# EAGLE design M500B (EAGLE 6.6.0)
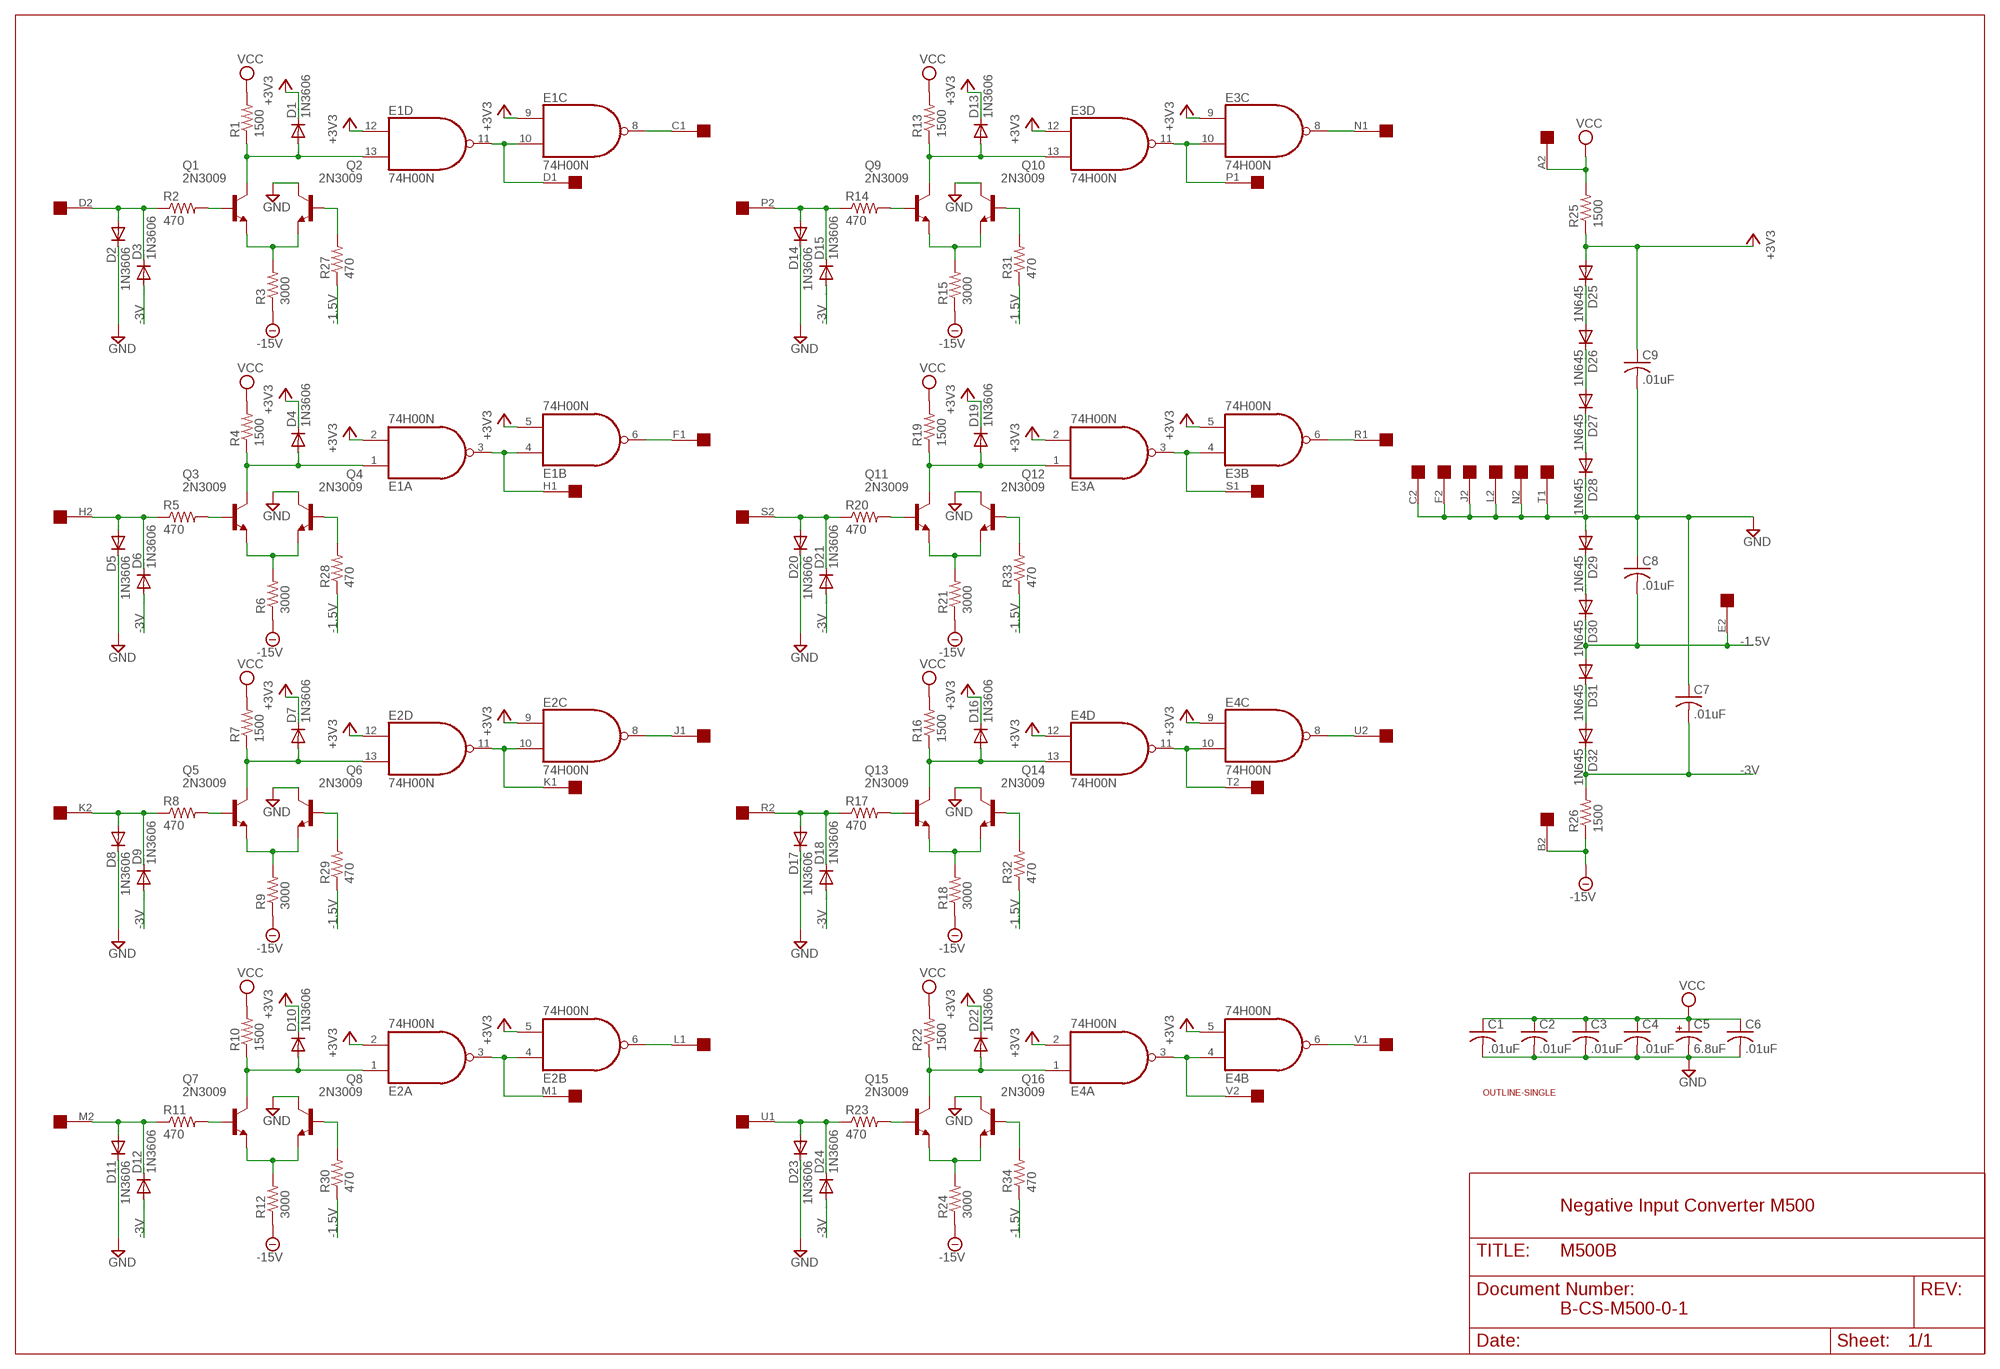
[diagram p0: schematic, sheet 1]

## Parts
C1  .01uF  C-US050-025X075  [C050-025X075]
C2  .01uF  C-US050-025X075  [C050-025X075]
C3  .01uF  C-US050-025X075  [C050-025X075]
C4  .01uF  C-US050-025X075  [C050-025X075]
C5  6.8uF  CPOL-USE20-8AXIAL  [E12-8]
C6  .01uF  C-US050-025X075  [C050-025X075]
C7  .01uF  C-US050-025X075  [C050-025X075]
C8  .01uF  C-US050-025X075  [C050-025X075]
C9  .01uF  C-US050-025X075  [C050-025X075]
D1  1N3606  1N4148DO35-10  [DO35-10]
D2  1N3606  1N4148DO35-10  [DO35-10]
D3  1N3606  1N4148DO35-10  [DO35-10]
D4  1N3606  1N4148DO35-10  [DO35-10]
D5  1N3606  1N4148DO35-10  [DO35-10]
D6  1N3606  1N4148DO35-10  [DO35-10]
D7  1N3606  1N4148DO35-10  [DO35-10]
D8  1N3606  1N4148DO35-10  [DO35-10]
D9  1N3606  1N4148DO35-10  [DO35-10]
D10  1N3606  1N4148DO35-10  [DO35-10]
D11  1N3606  1N4148DO35-10  [DO35-10]
D12  1N3606  1N4148DO35-10  [DO35-10]
D13  1N3606  1N4148DO35-10  [DO35-10]
D14  1N3606  1N4148DO35-10  [DO35-10]
D15  1N3606  1N4148DO35-10  [DO35-10]
D16  1N3606  1N4148DO35-10  [DO35-10]
D17  1N3606  1N4148DO35-10  [DO35-10]
D18  1N3606  1N4148DO35-10  [DO35-10]
D19  1N3606  1N4148DO35-10  [DO35-10]
D20  1N3606  1N4148DO35-10  [DO35-10]
D21  1N3606  1N4148DO35-10  [DO35-10]
D22  1N3606  1N4148DO35-10  [DO35-10]
D23  1N3606  1N4148DO35-10  [DO35-10]
D24  1N3606  1N4148DO35-10  [DO35-10]
D25  1N645  1N4148DO35-10  [DO35-10]
D26  1N645  1N4148DO35-10  [DO35-10]
D27  1N645  1N4148DO35-10  [DO35-10]
D28  1N645  1N4148DO35-10  [DO35-10]
D29  1N645  1N4148DO35-10  [DO35-10]
D30  1N645  1N4148DO35-10  [DO35-10]
D31  1N645  1N4148DO35-10  [DO35-10]
D32  1N645  1N4148DO35-10  [DO35-10]
E1  74H00N  7400N  [DIL14]
E2  74H00N  7400N  [DIL14]
E3  74H00N  7400N  [DIL14]
E4  74H00N  7400N  [DIL14]
Q1  2N3009  2N3019  [TO39]
Q2  2N3009  2N3019  [TO39]
Q3  2N3009  2N3019  [TO39]
Q4  2N3009  2N3019  [TO39]
Q5  2N3009  2N3019  [TO39]
Q6  2N3009  2N3019  [TO39]
Q7  2N3009  2N3019  [TO39]
Q8  2N3009  2N3019  [TO39]
Q9  2N3009  2N3019  [TO39]
Q10  2N3009  2N3019  [TO39]
Q11  2N3009  2N3019  [TO39]
Q12  2N3009  2N3019  [TO39]
Q13  2N3009  2N3019  [TO39]
Q14  2N3009  2N3019  [TO39]
Q15  2N3009  2N3019  [TO39]
Q16  2N3009  2N3019  [TO39]
R1  1500  R-US_0207/10  [0207/10]
R2  470  R-US_0207/10  [0207/10]
R3  3000  R-US_0207/10  [0207/10]
R4  1500  R-US_0207/10  [0207/10]
R5  470  R-US_0207/10  [0207/10]
R6  3000  R-US_0207/10  [0207/10]
R7  1500  R-US_0207/10  [0207/10]
R8  470  R-US_0207/10  [0207/10]
R9  3000  R-US_0207/10  [0207/10]
R10  1500  R-US_0207/10  [0207/10]
R11  470  R-US_0207/10  [0207/10]
R12  3000  R-US_0207/10  [0207/10]
R13  1500  R-US_0207/10  [0207/10]
R14  470  R-US_0207/10  [0207/10]
R15  3000  R-US_0207/10  [0207/10]
R16  1500  R-US_0207/10  [0207/10]
R17  470  R-US_0207/10  [0207/10]
R18  3000  R-US_0207/10  [0207/10]
R19  1500  R-US_0207/10  [0207/10]
R20  470  R-US_0207/10  [0207/10]
R21  3000  R-US_0207/10  [0207/10]
R22  1500  R-US_0207/10  [0207/10]
R23  470  R-US_0207/10  [0207/10]
R24  3000  R-US_0207/10  [0207/10]
R25  1500  R-US_0207/10  [0207/10]
R26  1500  R-US_0207/10  [0207/10]
R27  470  R-US_0207/10  [0207/10]
R28  470  R-US_0207/10  [0207/10]
R29  470  R-US_0207/10  [0207/10]
R30  470  R-US_0207/10  [0207/10]
R31  470  R-US_0207/10  [0207/10]
R32  470  R-US_0207/10  [0207/10]
R33  470  R-US_0207/10  [0207/10]
R34  470  R-US_0207/10  [0207/10]
U$1  OUTLINE-SINGLE  [SINGLE]
U$3  SINGLE  [EDGE-CON2]

## Nets
+3V3 [power]: C9.1 D1.C D4.C D7.C D10.C D13.C D16.C D19.C D22.C D25.A E1.2(A:I1) E1.5(B:I1) E1.9(C:I0) E1.12(D:I0) E2.2(A:I1) E2.5(B:I1) E2.9(C:I0) E2.12(D:I0) E3.2(A:I1) E3.5(B:I1) E3.9(C:I0) E3.12(D:I0) E4.2(A:I1) E4.5(B:I1) E4.9(C:I0) E4.12(D:I0) R25.1
-1.5V: C8.2 D30.C D31.A R27.1 R28.1 R29.1 R30.1 R31.1 R32.1 R33.1 R34.1 U$3.E2
-3V: C7.2 D3.A D6.A D9.A D12.A D15.A D18.A D21.A D24.A D32.C R26.2
-15V: R3.1 R6.1 R9.1 R12.1 R15.1 R18.1 R21.1 R24.1 R26.1 U$3.B2
GND [power]: C1.2 C2.2 C3.2 C4.2 C5.- C6.2 C7.1 C8.1 C9.2 D2.C D5.C D8.C D11.C D14.C D17.C D20.C D23.C D28.C D29.A Q2.3(C) Q4.3(C) Q6.3(C) Q8.3(C) Q10.3(C) Q12.3(C) Q14.3(C) Q16.3(C) U$3.C2 U$3.F2 U$3.J2 U$3.L2 U$3.N2 U$3.T1
N$1: E1.10(C:I1) E1.11(D:O) U$3.D1
N$2: E1.8(C:O) U$3.C1
N$3: Q1.1(E) Q2.1(E) R3.2
N$4: D1.A E1.13(D:I1) Q1.3(C) R1.1
N$5: Q1.2(B) R2.2
N$6: D2.A D3.C R2.1 U$3.D2
N$8: Q2.2(B) R27.2
N$9: E1.3(A:O) E1.4(B:I0) U$3.H1
N$10: E1.6(B:O) U$3.F1
N$11: Q3.1(E) Q4.1(E) R6.2
N$12: D4.A E1.1(A:I0) Q3.3(C) R4.1
N$13: Q3.2(B) R5.2
N$14: D5.A D6.C R5.1 U$3.H2
N$15: D27.C D28.A
N$16: Q4.2(B) R28.2
N$17: E2.10(C:I1) E2.11(D:O) U$3.K1
N$18: E2.8(C:O) U$3.J1
N$19: Q5.1(E) Q6.1(E) R9.2
N$20: D7.A E2.13(D:I1) Q5.3(C) R7.1
N$21: Q5.2(B) R8.2
N$22: D8.A D9.C R8.1 U$3.K2
N$23: D26.C D27.A
N$24: Q6.2(B) R29.2
N$25: E2.3(A:O) E2.4(B:I0) U$3.M1
N$26: E2.6(B:O) U$3.L1
N$27: Q7.1(E) Q8.1(E) R12.2
N$28: D10.A E2.1(A:I0) Q7.3(C) R10.1
N$29: Q7.2(B) R11.2
N$30: D11.A D12.C R11.1 U$3.M2
N$31: D25.C D26.A
N$32: Q8.2(B) R30.2
N$33: E3.10(C:I1) E3.11(D:O) U$3.P1
N$34: E3.8(C:O) U$3.N1
N$35: Q9.1(E) Q10.1(E) R15.2
N$36: D13.A E3.13(D:I1) Q9.3(C) R13.1
N$37: Q9.2(B) R14.2
N$38: D14.A D15.C R14.1 U$3.P2
N$39: D29.C D30.A
N$40: Q10.2(B) R31.2
N$41: E3.3(A:O) E3.4(B:I0) U$3.S1
N$42: E3.6(B:O) U$3.R1
N$43: Q11.1(E) Q12.1(E) R21.2
N$44: D19.A E3.1(A:I0) Q11.3(C) R19.1
N$45: Q11.2(B) R20.2
N$46: D20.A D21.C R20.1 U$3.S2
N$47: D31.C D32.A
N$48: Q12.2(B) R33.2
N$49: E4.10(C:I1) E4.11(D:O) U$3.T2
N$50: E4.8(C:O) U$3.U2
N$51: Q13.1(E) Q14.1(E) R18.2
N$52: D16.A E4.13(D:I1) Q13.3(C) R16.1
N$53: Q13.2(B) R17.2
N$54: D17.A D18.C R17.1 U$3.R2
N$56: Q14.2(B) R32.2
N$57: E4.3(A:O) E4.4(B:I0) U$3.V2
N$58: E4.6(B:O) U$3.V1
N$59: Q15.1(E) Q16.1(E) R24.2
N$60: D22.A E4.1(A:I0) Q15.3(C) R22.1
N$61: Q15.2(B) R23.2
N$62: D23.A D24.C R23.1 U$3.U1
N$64: Q16.2(B) R34.2
VCC [power]: C1.1 C2.1 C3.1 C4.1 C5.+ C6.1 R1.2 R4.2 R7.2 R10.2 R13.2 R16.2 R19.2 R22.2 R25.2 U$3.A2
Unconnected: U$3.A1 U$3.B1 U$3.E1

## Notes on the sheet
- Negative Input Converter M500
- B-CS-M500-0-1

## Power pins joined to a net without a drawn wire
GND: E1.7(P:GND) E2.7(P:GND) E3.7(P:GND) E4.7(P:GND)
VCC: E1.14(P:VCC) E2.14(P:VCC) E3.14(P:VCC) E4.14(P:VCC)

## Library data of the parts
C1-C4 C6-C9 = rcl:C-US: CAPACITOR, American symbol
C5 = dec-con:CPOL-USE20-8AXIAL: A 0.8 inch electrolytic.
D1-D32 = diode:1N4148: DIODE high speed (Philips)
E1-E4 = 74xx-us:74*00: Quad 2-input NAND gate
Q1-Q16 = transistor-npn:2N3019: NPN Transistor
R1-R34 = rcl:R-US_: RESISTOR, American symbol
U$1 = dec-con:OUTLINE-*: Board outlines for DEC boards.
U$3 = dec-con:SINGLE: Single-Height DEC board

## Net classes
1 power: width 0.813 mm

## Board
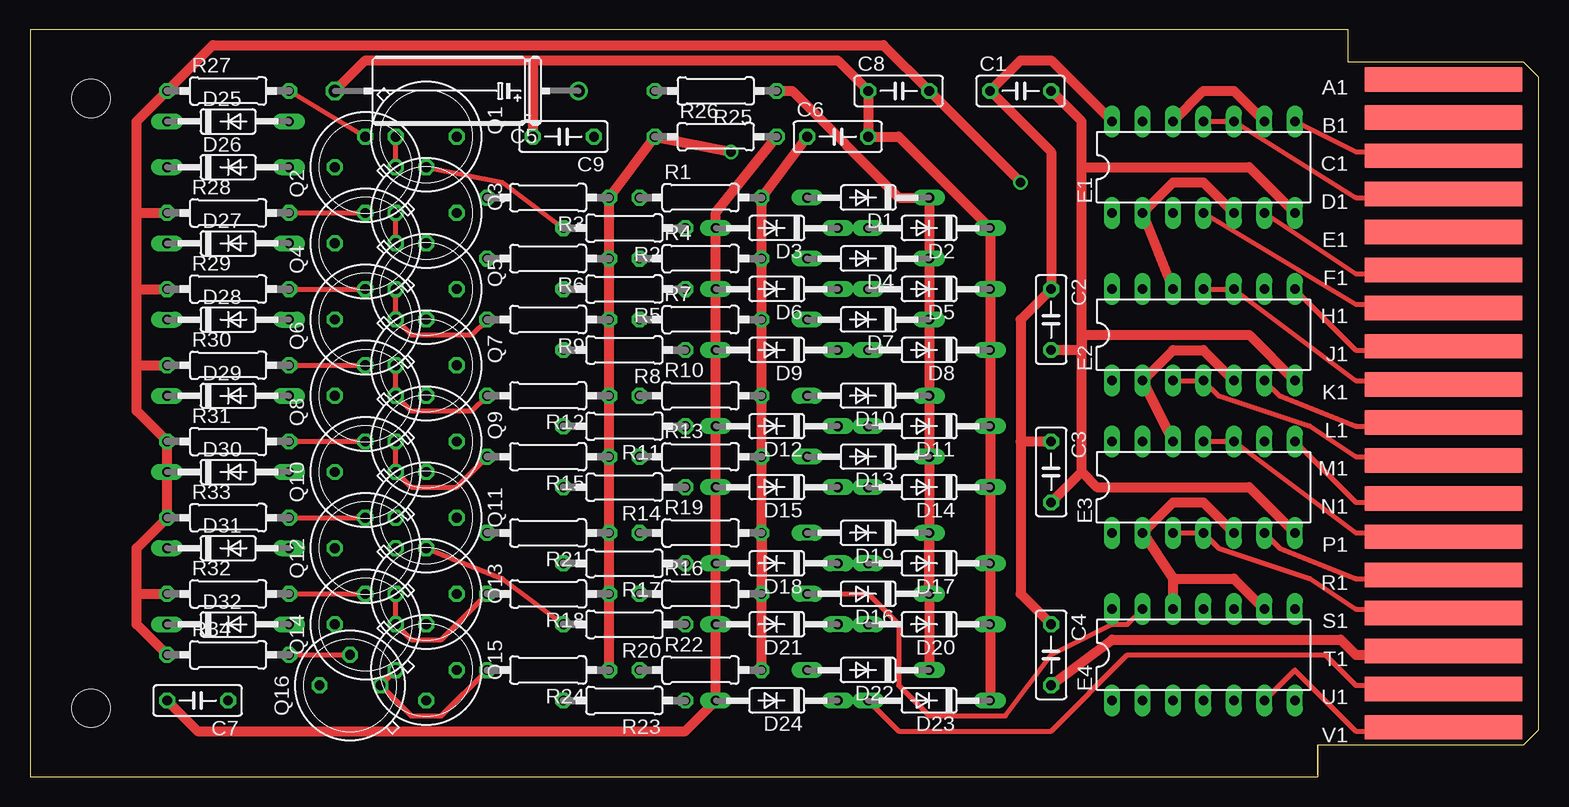
[diagram p1: board, top side]
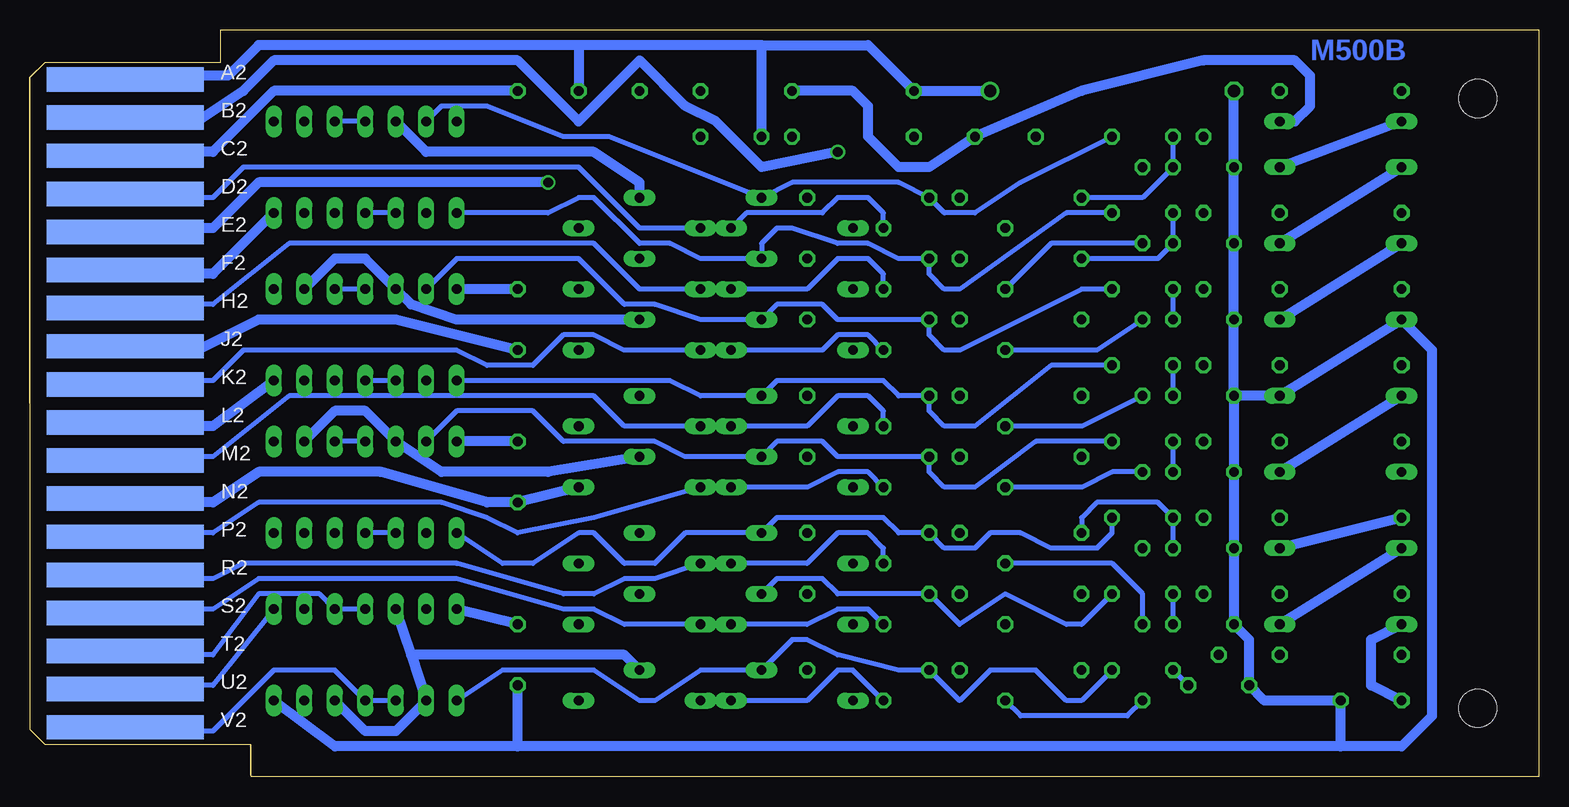
[diagram p2: board, bottom side, seen from below]

Size 125.73 x 62.23 mm. Coordinates in mm from the lower left corner, seen from the top.
Copper layers (1+16): Top 0.035mm / dielectric 1.5mm / Bottom 0.035mm
Design rules "16mils": minimum track width 16mil, minimum drill 32mil, track to track 15mil, track to pad 10mil, pad to pad 10mil, via to via 10mil, smd to smd 10mil, copper to edge 13mil, drill to drill 10mil, minimum pad ring 10mil, minimum via ring 8mil, stop-mask expansion 0mil, vias tented up to drill 0mil, thermal gap 10mil

### Footprints (pad centres in the part's own frame; a part is rotated, then mirrored left to right if it is on the bottom)
C050-025X075 = drill 0.813 octagon: 1 -2.54,0; 2 2.54,0
E12-8 = drill 1.016: + -10.16,0 | drill 1.016 octagon: - 10.16,0
DO35-10 = drill 0.813 long: A 5.08,0; C -5.08,0
DIL14 = drill 0.813 long: 1 -7.62,-3.81; 2 -5.08,-3.81; 3 -2.54,-3.81; 4 0,-3.81; 5 2.54,-3.81; 6 5.08,-3.81; 7 7.62,-3.81; 8 7.62,3.81; 9 5.08,3.81; 10 2.54,3.81; 11 0,3.81; 12 -2.54,3.81; 13 -5.08,3.81; 14 -7.62,3.81
TO39 = drill 0.813 octagon: 1 0,-2.54; 2 2.54,0; 3 0,2.54
0207/10 = drill 0.813 octagon: 1 -5.08,0; 2 5.08,0
SINGLE = hole 3.175: 120.65,56.515; 120.65,5.715
EDGE-CON2 = smd 13.106 x 2.032: A1 7.938,4.128; B1 7.938,7.303; C1 7.938,10.477; D1 7.938,13.652; E1 7.938,16.828; F1 7.938,20.003; H1 7.938,23.177; J1 7.938,26.352; K1 7.938,29.527; L1 7.938,32.703; M1 7.938,35.877; N1 7.938,39.053; P1 7.938,42.227; R1 7.938,45.403; S1 7.938,48.578; T1 7.938,51.752; U1 7.938,54.928; V1 7.938,58.102 | smd 13.106 x 2.032 bottom: A2 7.938,4.128; B2 7.938,7.303; C2 7.938,10.477; D2 7.938,13.652; E2 7.938,16.828; F2 7.938,20.003; H2 7.938,23.177; J2 7.938,26.352; K2 7.938,29.527; L2 7.938,32.703; M2 7.938,35.877; N2 7.938,39.053; P2 7.938,42.227; R2 7.938,45.403; S2 7.938,48.578; T2 7.938,51.752; U2 7.938,54.928; V2 7.938,58.102

### Placement (x,y rotation side)
C1  82.55,57.15 0 top
C2  85.09,38.1 270 top
C3  85.09,25.4 270 top
C4  85.09,10.16 270 top
C5  35.56,57.15 180 top
C6  67.31,53.34 0 top
C7  13.97,6.35 180 top
C8  72.39,57.15 0 top
C9  44.45,53.34 180 top
D1  69.85,48.26 180 top
D2  74.93,45.72 180 top
D3  62.23,45.72 180 top
D4  69.85,43.18 180 top
D5  74.93,40.64 180 top
D6  62.23,40.64 180 top
D7  69.85,38.1 180 top
D8  74.93,35.56 180 top
D9  62.23,35.56 180 top
D10  69.85,31.75 180 top
D11  74.93,29.21 180 top
D12  62.23,29.21 180 top
D13  69.85,26.67 180 top
D14  74.93,24.13 180 top
D15  62.23,24.13 180 top
D16  69.85,15.24 180 top
D17  74.93,17.78 180 top
D18  62.23,17.78 180 top
D19  69.85,20.32 180 top
D20  74.93,12.7 180 top
D21  62.23,12.7 180 top
D22  69.85,8.89 180 top
D23  74.93,6.35 180 top
D24  62.23,6.35 180 top
D25  16.51,54.61 0 top
D26  16.51,50.8 0 top
D27  16.51,44.45 0 top
D28  16.51,38.1 0 top
D29  16.51,31.75 0 top
D30  16.51,25.4 0 top
D31  16.51,19.05 0 top
D32  16.51,12.7 0 top
E1  97.79,50.8 0 top
E2  97.79,36.83 0 top
E3  97.79,24.13 0 top
E4  97.79,10.16 0 top
Q1  33.02,53.34 270 top
Q2  27.94,50.8 90 top
Q3  33.02,46.99 270 top
Q4  27.94,44.45 90 top
Q5  33.02,40.64 270 top
Q6  27.94,38.1 90 top
Q7  33.02,34.29 270 top
Q8  27.94,31.75 90 top
Q9  33.02,27.94 270 top
Q10  27.94,25.4 90 top
Q11  33.02,21.59 270 top
Q12  27.94,19.05 90 top
Q13  33.02,15.24 270 top
Q14  27.94,12.7 90 top
Q15  33.02,8.89 270 top
Q16  26.67,7.62 90 top
R1  55.88,48.26 0 top
R2  49.53,45.72 180 top
R3  43.18,48.26 180 top
R4  55.88,43.18 0 top
R5  49.53,40.64 180 top
R6  43.18,43.18 180 top
R7  55.88,38.1 0 top
R8  49.53,35.56 180 top
R9  43.18,38.1 180 top
R10  55.88,31.75 0 top
R11  49.53,29.21 180 top
R12  43.18,31.75 180 top
R13  55.88,26.67 0 top
R14  49.53,24.13 180 top
R15  43.18,26.67 180 top
R16  55.88,15.24 0 top
R17  49.53,17.78 180 top
R18  43.18,15.24 180 top
R19  55.88,20.32 0 top
R20  49.53,12.7 180 top
R21  43.18,20.32 180 top
R22  55.88,8.89 0 top
R23  49.53,6.35 180 top
R24  43.18,8.89 180 top
R25  57.15,57.15 180 top
R26  57.15,53.34 0 top
R27  16.51,57.15 0 top
R28  16.51,46.99 0 top
R29  16.51,40.64 0 top
R30  16.51,34.29 0 top
R31  16.51,27.94 0 top
R32  16.51,15.24 0 top
R33  16.51,21.59 0 top
R34  16.51,10.16 0 top
U$1  125.73,62.23 180 top
U$3  125.73,62.23 180 top

### Tracks (layer width: path | path; a pad name or v marks a point on that pad's centre or on a via)
+3V3
  Top 0.813: D22.C D19.C D16.C D13.C D10.C D7.C D4.C D1.C 72.39,48.26 63.5,57.15 R25.1 | E4.9 100.33,16.51 95.25,16.51 | E4.12 95.25,16.51 | 95.25,16.51 E3.2 95.25,22.86 97.79,22.86 E3.5 | E3.12 E2.2 95.25,35.56 97.79,35.56 E2.5 | E2.12 E1.2 95.25,49.53 97.79,49.53 E1.5 | E1.12 97.79,57.15 100.33,57.15 E1.9
  Bottom 0.813: E3.9 100.33,30.48 97.79,30.48 E3.12 91.44,25.4 82.55,25.4 D13.C | E4.5 97.79,3.81 95.25,3.81 E4.2 93.98,10.16 | 93.98,10.16 E4.12 | E2.9 100.33,43.18 97.79,43.18 E2.12 93.98,39.37 90.17,38.1 D7.C | E1.12 92.71,52.07 78.74,52.07 74.93,49.53 D1.C | D22.C 76.2,10.16 93.98,10.16 | D25.A 20.32,54.61 19.05,55.88 19.05,58.42 20.32,59.69 27.94,59.69 38.1,57.15 C9.1 50.8,50.8 53.34,50.8 55.88,53.34 55.88,55.88 57.15,57.15 R25.1
-1.5V  (via drill 0.81)
  Top 0.813: R34.1 8.89,12.7 8.89,15.24 | 8.89,15.24 8.89,19.05 R33.1 D30.C R31.1 8.89,30.48 8.89,34.29 | 8.89,34.29 R30.1 | 8.89,34.29 8.89,40.64 | 8.89,40.64 8.89,46.99 | 8.89,46.99 8.89,54.61 R27.1 15.24,60.96 71.12,60.96 C8.2 v82.55,49.53 | 8.89,46.99 R28.1 | 8.89,40.64 R29.1 | 8.89,15.24 R32.1
  Bottom 0.813: U$3.E2 116.84,45.72 110.49,45.72 106.68,49.53 v82.55,49.53 | R33.1 D31.A
-3V
  Top 0.813: C7.2 13.97,3.81 54.61,3.81 D24.A D21.A D18.A D15.A D12.A D9.A D6.A D3.A 57.15,46.99 R26.2
  Bottom 0.813: C7.2 13.97,7.62 13.97,11.43 D32.C
-15V  (via drill 0.81)
  Top 0.813: R24.1 R18.1 R21.1 R15.1 R12.1 R9.1 R6.1 R3.1 R26.1 v58.42,52.07
  Bottom 0.813: U$3.B2 116.84,54.61 111.76,54.61 107.95,57.15 105.41,59.69 85.09,59.69 80.01,54.61 74.93,59.69 71.12,55.88 68.58,54.61 64.77,50.8 v58.42,52.07
GND
  Top 0.813: D23.C D20.C D17.C D14.C D11.C D8.C D5.C D2.C 72.39,53.34 C6.2 C8.1 67.31,59.69 41.91,59.69 | C3.2 87.63,25.4 | 87.63,25.4 87.63,36.83 | 87.63,36.83 87.63,50.8 | 87.63,50.8 87.63,54.61 C1.2 | 87.63,36.83 87.63,35.56 C2.2 | U$3.T1 116.84,10.16 110.49,10.16 109.22,11.43 90.17,11.43 C4.2 | E1.7 101.6,50.8 87.63,50.8 | E2.7 101.6,36.83 87.63,36.83 | E3.7 101.6,24.13 88.9,24.13 87.63,25.4 | 41.91,59.69 27.94,59.69 C5.- | 41.91,59.69 C9.2
  Bottom 0.813: C5.- Q2.3 Q4.3 Q6.3 Q8.3 | Q12.3 Q14.3 | Q14.3 24.13,11.43 Q16.3 22.86,6.35 C7.1 16.51,2.54 | Q12.3 Q14.3 | Q12.3 Q14.3 | Q8.3 Q10.3 Q12.3 | Q8.3 D29.A D28.C 8.89,35.56 8.89,5.08 11.43,2.54 16.51,2.54 | U$3.C2 116.84,52.07 110.49,52.07 105.41,57.15 C1.2 | E4.7 100.33,2.54 85.09,2.54 | 85.09,2.54 C4.2 | 16.51,2.54 85.09,2.54 | U$3.N2 116.84,22.86 110.49,22.86 106.68,25.4 96.52,25.4 87.63,22.86 C3.2 D14.C | U$3.F2 115.57,41.91 110.49,41.91 E1.7 | U$3.L2 116.84,29.21 110.49,29.21 E2.7 | U$3.J2 116.84,35.56 111.76,35.56 106.68,38.1 95.25,38.1 C2.2
N$1
  Top 0.406: U$3.D1 116.84,48.26 110.49,48.26 E1.10 E1.11
  Bottom 0.406: E1.11 E1.10
N$2
  Top 0.406: U$3.C1 116.84,52.07 110.49,52.07 E1.8
N$3
  Top 0.406: Q2.1 Q1.1
  Bottom 0.406: R3.2 33.02,48.26 Q2.1 Q1.1
N$4
  Bottom 0.406: E1.13 91.44,55.88 87.63,55.88 81.28,53.34 77.47,53.34 D1.A 62.23,49.53 53.34,49.53 R1.1 49.53,46.99 46.99,46.99 43.18,49.53 Q1.3
N$5
  Top 0.406: Q1.2 39.37,49.53 R2.2
N$6
  Bottom 0.406: U$3.D2 116.84,48.26 110.49,48.26 107.95,50.8 80.01,50.8 74.93,45.72 D2.A D3.C 66.04,46.99 59.69,46.99 58.42,48.26 55.88,48.26 54.61,46.99 R2.1
N$8
  Top 0.406: R27.2 Q2.2
N$9
  Top 0.406: U$3.H1 116.84,39.37 110.49,39.37 E1.4
  Bottom 0.406: E1.3 E1.4
N$10
  Top 0.406: U$3.F1 116.84,41.91 110.49,41.91 E1.6
N$11
  Top 0.406: Q4.1 Q3.1
  Bottom 0.406: R6.2 31.75,43.18 Q4.1 Q3.1
N$12
  Bottom 0.406: E1.1 82.55,46.99 80.01,48.26 78.74,48.26 74.93,44.45 72.39,44.45 69.85,43.18 D4.A 64.77,44.45 63.5,45.72 62.23,45.72 58.42,44.45 55.88,44.45 53.34,43.18 R4.1 50.8,41.91 49.53,40.64 48.26,40.64 39.37,46.99 Q3.3
N$13
  Bottom 0.406: Q3.2 40.64,44.45 R5.2
N$14
  Bottom 0.406: U$3.H2 116.84,39.37 110.49,39.37 104.14,44.45 78.74,44.45 74.93,40.64 D5.A D6.C 60.96,40.64 58.42,43.18 55.88,43.18 54.61,41.91 R5.1
N$15
  Bottom 0.813: D27.C D28.A
N$16
  Top 0.406: R28.2 Q4.2
N$17
  Top 0.406: E2.11 E2.10 110.49,33.02 116.84,33.02 U$3.K1
  Bottom 0.406: E2.11 E2.10
N$18
  Top 0.406: U$3.J1 116.84,35.56 110.49,35.56 E2.8
N$19
  Top 0.406: Q5.1 Q6.1 31.75,36.83 36.83,36.83 R9.2
  Bottom 0.406: Q6.1 Q5.1
N$20
  Bottom 0.406: E2.13 90.17,43.18 80.01,43.18 76.2,39.37 73.66,39.37 69.85,38.1 D7.A 63.5,39.37 59.69,39.37 58.42,38.1 R7.1 50.8,36.83 49.53,35.56 48.26,35.56 38.1,40.64 Q5.3
N$21
  Bottom 0.406: R8.2 36.83,35.56 Q5.2
N$22
  Bottom 0.406: U$3.K2 116.84,33.02 110.49,33.02 107.95,35.56 90.17,35.56 87.63,34.29 83.82,34.29 81.28,36.83 78.74,36.83 76.2,35.56 D8.A D9.C 59.69,35.56 58.42,36.83 55.88,36.83 R8.1
N$23
  Bottom 0.813: D26.C D27.A
N$24
  Top 0.406: R29.2 Q6.2
N$25
  Top 0.406: E2.3 E2.4 99.06,31.75 106.68,29.21 110.49,26.67 116.84,26.67 U$3.M1
  Bottom 0.406: E2.3 E2.4
N$26
  Top 0.406: U$3.L1 116.84,29.21 110.49,29.21 104.14,31.75 E2.6
N$27
  Top 0.406: Q7.1 Q8.1 31.75,30.48 36.83,30.48 R12.2
  Bottom 0.406: Q8.1 Q7.1
N$28
  Bottom 0.406: E2.1 72.39,33.02 69.85,31.75 D10.A 63.5,33.02 54.61,33.02 53.34,31.75 R10.1 50.8,30.48 49.53,29.21 46.99,29.21 40.64,34.29 Q7.3
N$29
  Bottom 0.406: R11.2 38.1,29.21 Q7.2
N$30
  Bottom 0.406: U$3.M2 116.84,26.67 110.49,26.67 104.14,31.75 78.74,31.75 76.2,29.21 D11.A D12.C 60.96,29.21 58.42,31.75 55.88,31.75 54.61,30.48 R11.1
N$31
  Bottom 0.813: D25.C D26.A
N$32
  Top 0.406: R30.2 Q8.2
N$33
  Top 0.406: E3.11 E3.10 110.49,20.32 116.84,20.32 U$3.P1
  Bottom 0.406: E3.11 E3.10
N$34
  Top 0.406: U$3.N1 116.84,22.86 110.49,22.86 E3.8
N$35
  Top 0.406: Q9.1 Q10.1 31.75,24.13 35.56,24.13 R15.2
  Bottom 0.406: Q10.1 Q9.1
N$36
  Bottom 0.406: E3.13 90.17,30.48 83.82,30.48 81.28,27.94 73.66,27.94 71.12,26.67 D13.A 63.5,27.94 59.69,27.94 58.42,26.67 R13.1 50.8,25.4 49.53,24.13 46.99,24.13 41.91,27.94 Q9.3
N$37
  Bottom 0.406: R14.2 38.1,24.13 35.56,25.4 Q9.2
N$38
  Bottom 0.406: U$3.P2 116.84,20.32 110.49,20.32 106.68,22.86 91.44,22.86 87.63,21.59 85.09,20.32 78.74,21.59 D14.A D15.C 60.96,24.13 58.42,25.4 55.88,25.4 R14.1
N$39
  Bottom 0.813: D29.C D30.A
N$40
  Top 0.406: R31.2 Q10.2
N$41
  Top 0.406: U$3.S1 116.84,13.97 110.49,13.97 106.68,16.51 99.06,19.05 E3.4 E3.3
  Bottom 0.406: E3.3 E3.4
N$42
  Top 0.406: U$3.R1 116.84,16.51 110.49,16.51 104.14,19.05 E3.6
N$43
  Bottom 0.406: Q12.1 Q11.1 31.75,22.86 36.83,22.86 38.1,21.59 R21.2
N$44
  Bottom 0.406: Q11.3 35.56,20.32 36.83,19.05 40.64,19.05 43.18,20.32 45.72,20.32 46.99,19.05 49.53,19.05 R19.1 53.34,20.32 54.61,21.59 63.5,21.59 D19.A 71.12,20.32 73.66,17.78 76.2,17.78 78.74,20.32 80.01,20.32 83.82,17.78 86.36,17.78 E3.1
N$45
  Top 0.406: Q11.2 39.37,16.51 R20.2
N$46
  Bottom 0.406: U$3.S2 116.84,13.97 110.49,13.97 106.68,16.51 90.17,16.51 81.28,13.97 78.74,13.97 76.2,12.7 D20.A D21.C 60.96,12.7 58.42,13.97 55.88,13.97 R20.1
N$47
  Bottom 0.813: D31.C D32.A
N$48
  Top 0.406: R33.2 Q12.2
N$49
  Bottom 0.406: U$3.T2 116.84,10.16 110.49,10.16 106.68,15.24 101.6,15.24 E4.10 E4.11
N$50
  Bottom 0.406: U$3.U2 116.84,7.62 110.49,7.62 E4.8
N$51
  Top 0.406: R18.2 34.29,11.43 31.75,11.43 Q14.1 Q13.1
  Bottom 0.406: Q14.1 Q13.1
N$52
  Top 0.406: E4.13 91.44,12.7 90.17,12.7 85.09,10.16 81.28,5.08 74.93,5.08 72.39,7.62 72.39,12.7 69.85,15.24 D16.A
  Bottom 0.406: Q13.3 38.1,12.7 39.37,12.7 44.45,15.24 48.26,12.7 R16.1 58.42,15.24 59.69,16.51 63.5,16.51 D16.A
N$53
  Bottom 0.406: R17.2 35.56,17.78 33.02,15.24 Q13.2
N$54
  Bottom 0.406: U$3.R2 116.84,16.51 110.49,16.51 107.95,17.78 90.17,17.78 81.28,15.24 78.74,15.24 76.2,16.51 73.66,16.51 D17.A D18.C 60.96,17.78 58.42,20.32 55.88,20.32 54.61,19.05 R17.1
N$56
  Top 0.406: R32.2 Q14.2
N$57
  Bottom 0.406: U$3.V2 116.84,3.81 110.49,3.81 105.41,8.89 100.33,8.89 E4.4 E4.3
N$58
  Top 0.406: U$3.V1 116.84,3.81 110.49,3.81 105.41,8.89 E4.6
N$59
  Top 0.406: Q15.1 Q16.1 31.75,5.08 34.29,5.08 R24.2
  Bottom 0.406: Q16.1 Q15.1
N$60
  Bottom 0.406: E4.1 86.36,8.89 78.74,8.89 74.93,6.35 73.66,6.35 69.85,8.89 D22.A 62.23,11.43 60.96,11.43 58.42,10.16 53.34,8.89 R22.1 48.26,6.35 45.72,8.89 41.91,8.89 39.37,6.35 38.1,6.35 Q15.3
N$61
  Bottom 0.406: R23.2 43.18,5.08 34.29,5.08 Q15.2
N$62
  Top 0.406: U$3.U1 116.84,7.62 110.49,7.62 107.95,10.16 91.44,10.16 85.09,3.81 72.39,3.81 D23.A D24.C
  Bottom 0.406: D24.C 60.96,6.35 58.42,8.89 57.15,8.89 R23.1
N$64
  Top 0.406: R34.2 Q16.2
VCC
  Top 0.813: C6.1 R1.2 R4.2 R7.2 R10.2 R13.2 R16.2 R19.2 R22.2 | E1.14 85.09,59.69 82.55,59.69 C1.1 85.09,52.07 C2.1 82.55,38.1 82.55,27.94 | C4.1 82.55,15.24 82.55,27.94 | 82.55,27.94 C3.1
  Bottom 0.813: U$3.A2 116.84,58.42 109.22,58.42 106.68,60.96 80.01,60.96 | 64.77,60.96 80.01,60.96 | C6.1 64.77,60.96 | 80.01,60.96 C1.1 | 64.77,60.96 55.88,60.96 R25.2 C5.+ | C4.1 E4.14 | C3.1 E3.14 | C2.1 E2.14

### Text on the board
Bottom: M500B